# EAGLE design LandPatternBreakouts (EAGLE 6.5.0)
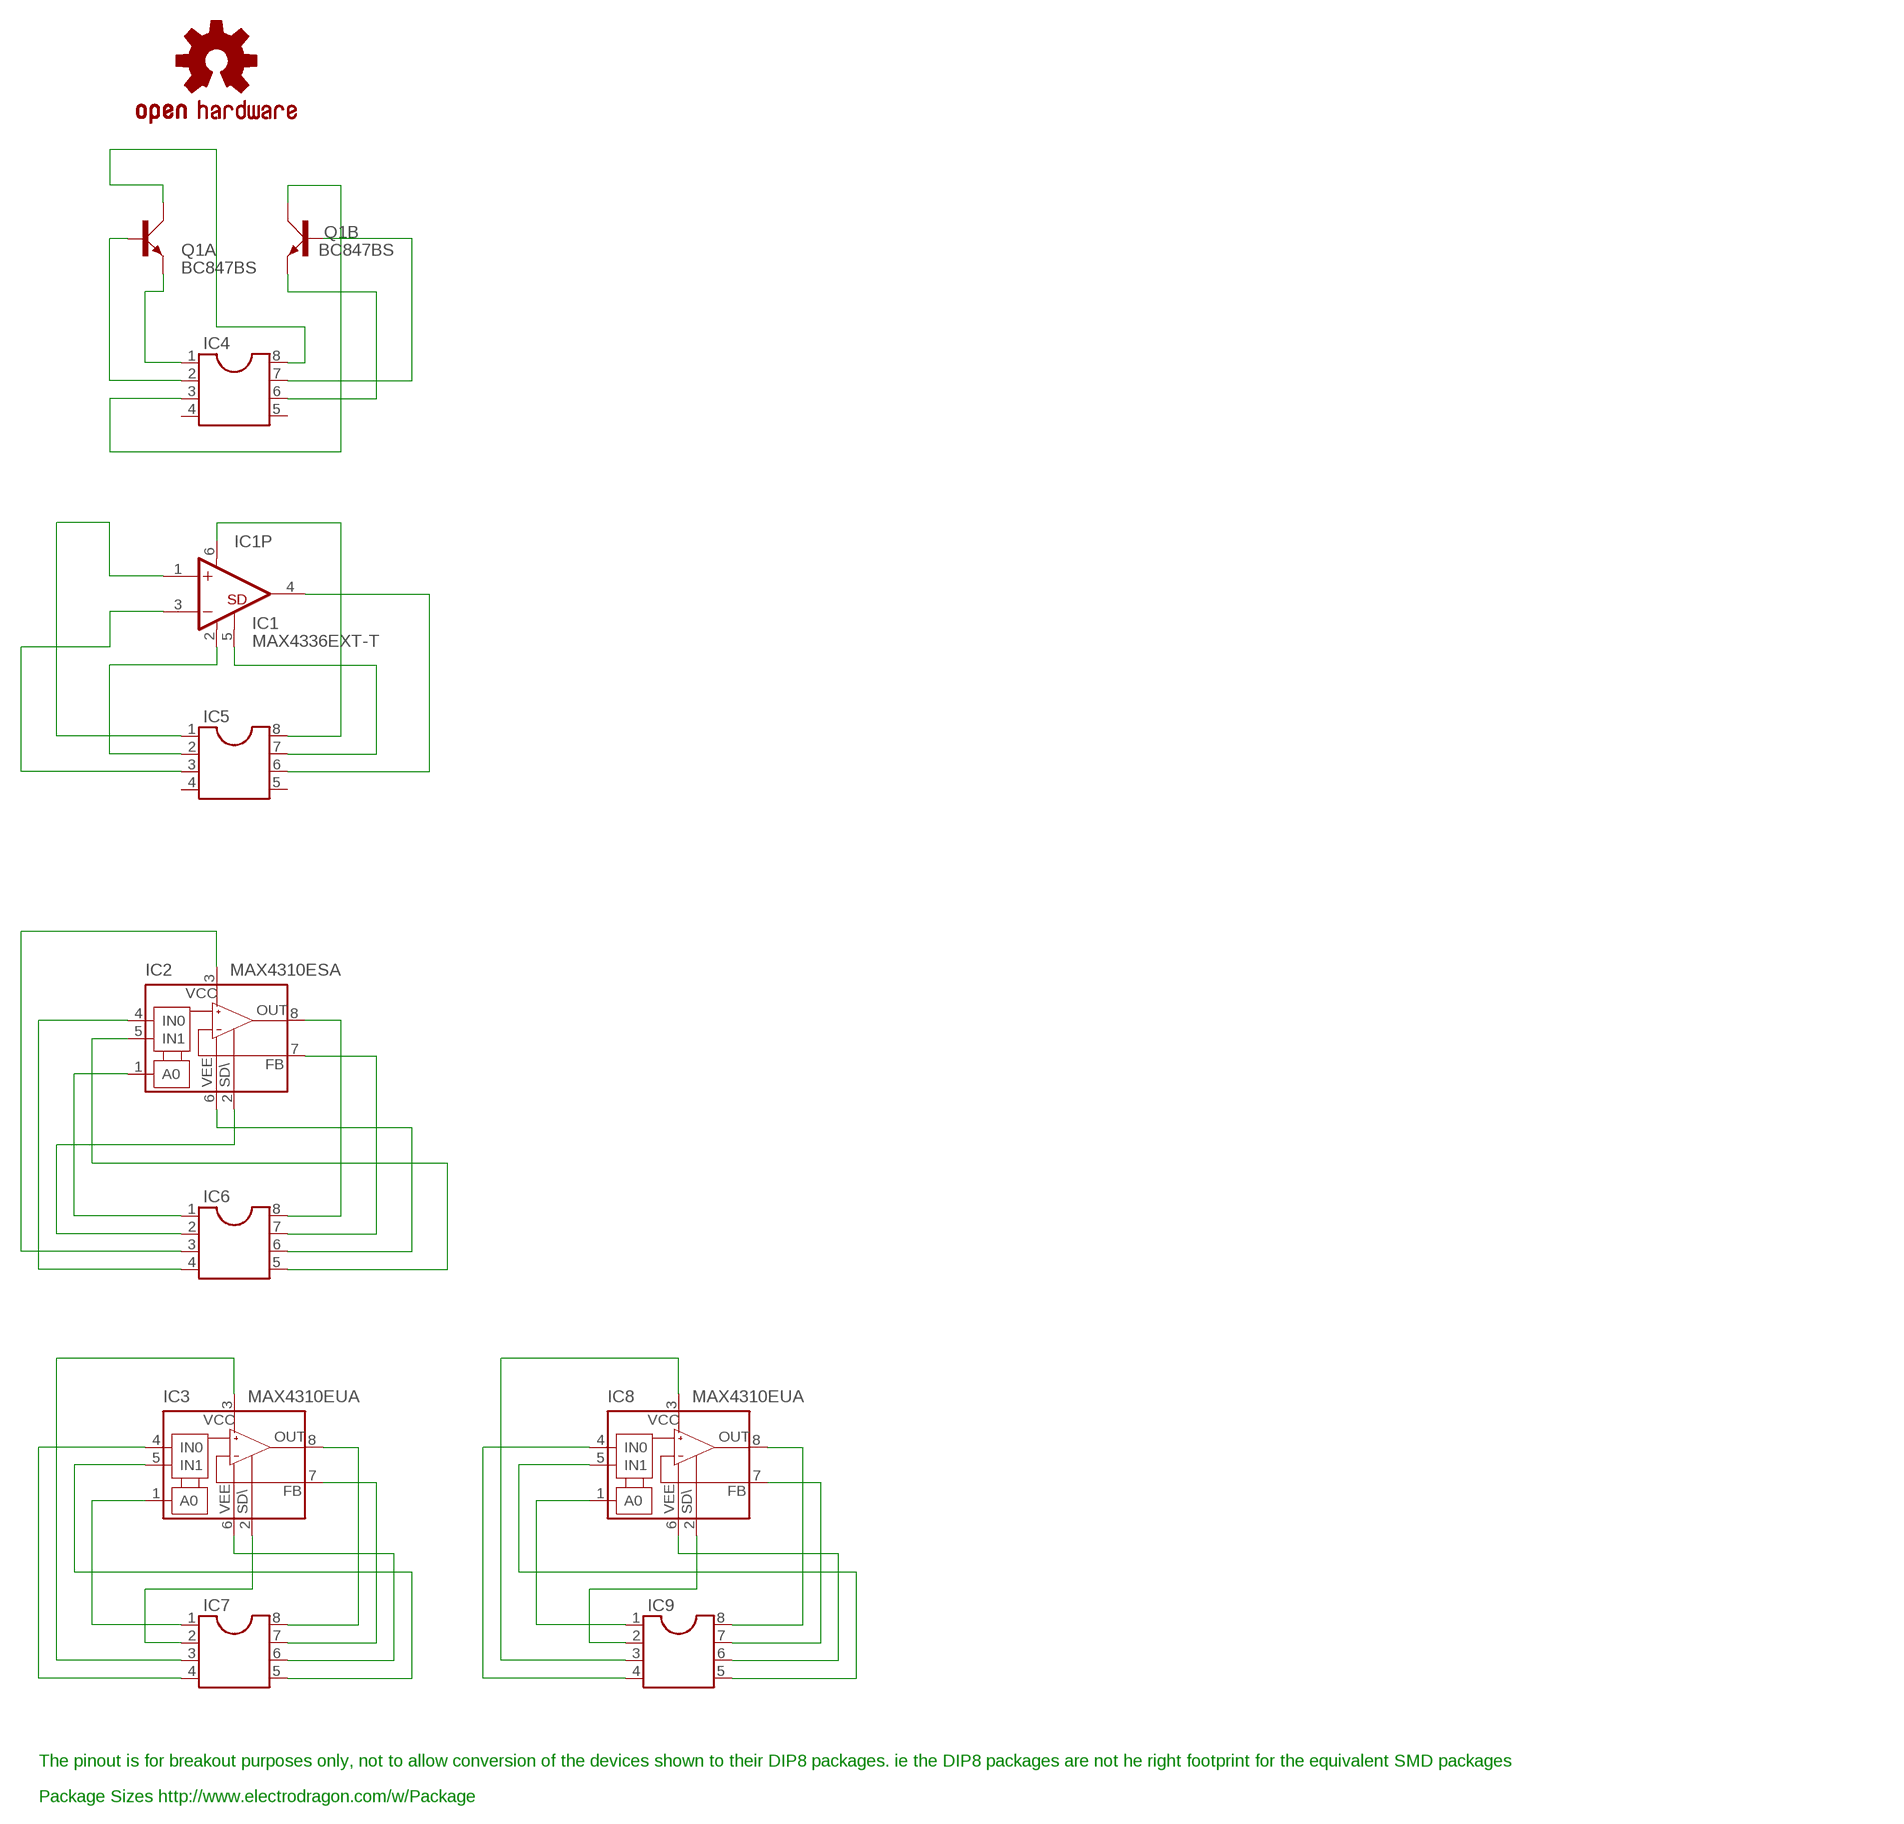
[diagram p0: schematic, sheet 1]

## Parts
IC1  MAX4336EXT-T  [SOT23-6L]
IC2  MAX4310ESA  [UMAX8]
IC3  MAX4310EUA  [SO08]
IC4  DIL8  [DIL08]
IC5  DIL8  [DIL08]
IC6  DIL8  [DIL08]
IC7  DIL8  [DIL08]
IC8  MAX4310EUA  [SO08]
IC9  DIL8  [DIL08]
LOGO1  OSHW-LOGOS  [OSHW-LOGO-S]
Q1  BC847BS  [SOT363_PHILIPS]

## Nets
N$1: IC1.1(+IN) IC5.1
N$2: IC1.2(V-) IC5.2
N$3: IC1.3(-IN) IC5.3
N$4: IC1.4(OUT) IC5.6
N$5: IC1.6(V+) IC5.8
N$6: IC2.1(A0) IC6.1
N$7: IC2.2(!SHDN) IC6.2
N$8: IC1.5(SHUTDOWN) IC5.7
N$9: IC2.3(V+) IC6.3
N$10: IC2.4(IN0) IC6.4
N$11: IC2.5(IN1) IC6.5
N$12: IC2.6(V-) IC6.6
N$13: IC2.7(FB) IC6.7
N$14: IC2.8(OUT) IC6.8
N$15: IC3.4(IN0) IC7.4
N$16: IC3.2(!SHDN) IC7.2
N$17: IC3.3(V+) IC7.3
N$18: IC3.5(IN1) IC7.5
N$19: IC3.6(V-) IC7.6
N$20: IC3.7(FB) IC7.7
N$21: IC3.8(OUT) IC7.8
N$22: IC3.1(A0) IC7.1
N$23: IC4.8 Q1.6(A:C)
N$24: IC4.2 Q1.2(A:B)
N$25: IC4.1 Q1.1(A:E)
N$26: IC4.6 Q1.4(B:E)
N$27: IC4.3 Q1.3(B:C)
N$28: IC4.7 Q1.5(B:B)
N$29: IC8.2(!SHDN) IC9.2
N$30: IC8.3(V+) IC9.3
N$31: IC8.4(IN0) IC9.4
N$32: IC8.5(IN1) IC9.5
N$33: IC8.6(V-) IC9.6
N$34: IC8.7(FB) IC9.7
N$35: IC8.8(OUT) IC9.8
N$36: IC8.1(A0) IC9.1
Unconnected: IC4.4 IC4.5 IC5.4 IC5.5

## Notes on the sheet
- The pinout is for breakout purposes only, not to allow conversion of the devices shown to their DIP8 packages. ie the DIP8 packages are not he right footprint for the equivalent SMD packages
- Package Sizes http://www.electrodragon.com/w/Package

## Library data of the parts
IC1 = maxim:MAX4336: 50mA IOUT, Rail-to-Rail I/O Op Amp with Shutdown/Mute Source: http://datasheets.maxim-ic.com/en/ds/MAX4335-MAX4338.pdf; MPN: MAX4336EXT+T; OC_FARNELL: unknown; OC_NEWARK: 27M4090
IC2 IC3 IC8 = maxim:MAX4310: Video Multiplexer-Amplifier High-Speed, Low-Power, Single-Supply, Multichannel; OC_FARNELL: unknown; OC_NEWARK: unknown
IC4-IC7 IC9 = ic-package:DIL8: Dual In Line / Socket
LOGO1 = SparkFun-Aesthetics:OSHW-LOGO: Open Source Hardware Logo This logo indicates the piece of hardware it is found on incorporates a OSHW license and/or adheres to the definition of open source hardware found here: http://freedomdefined.org/OSHW
Q1 = transistor-small-signal:BC847BS: NPN general purpose double transistor Source: http://www.farnell.com/datasheets/2466.pdf

## Board
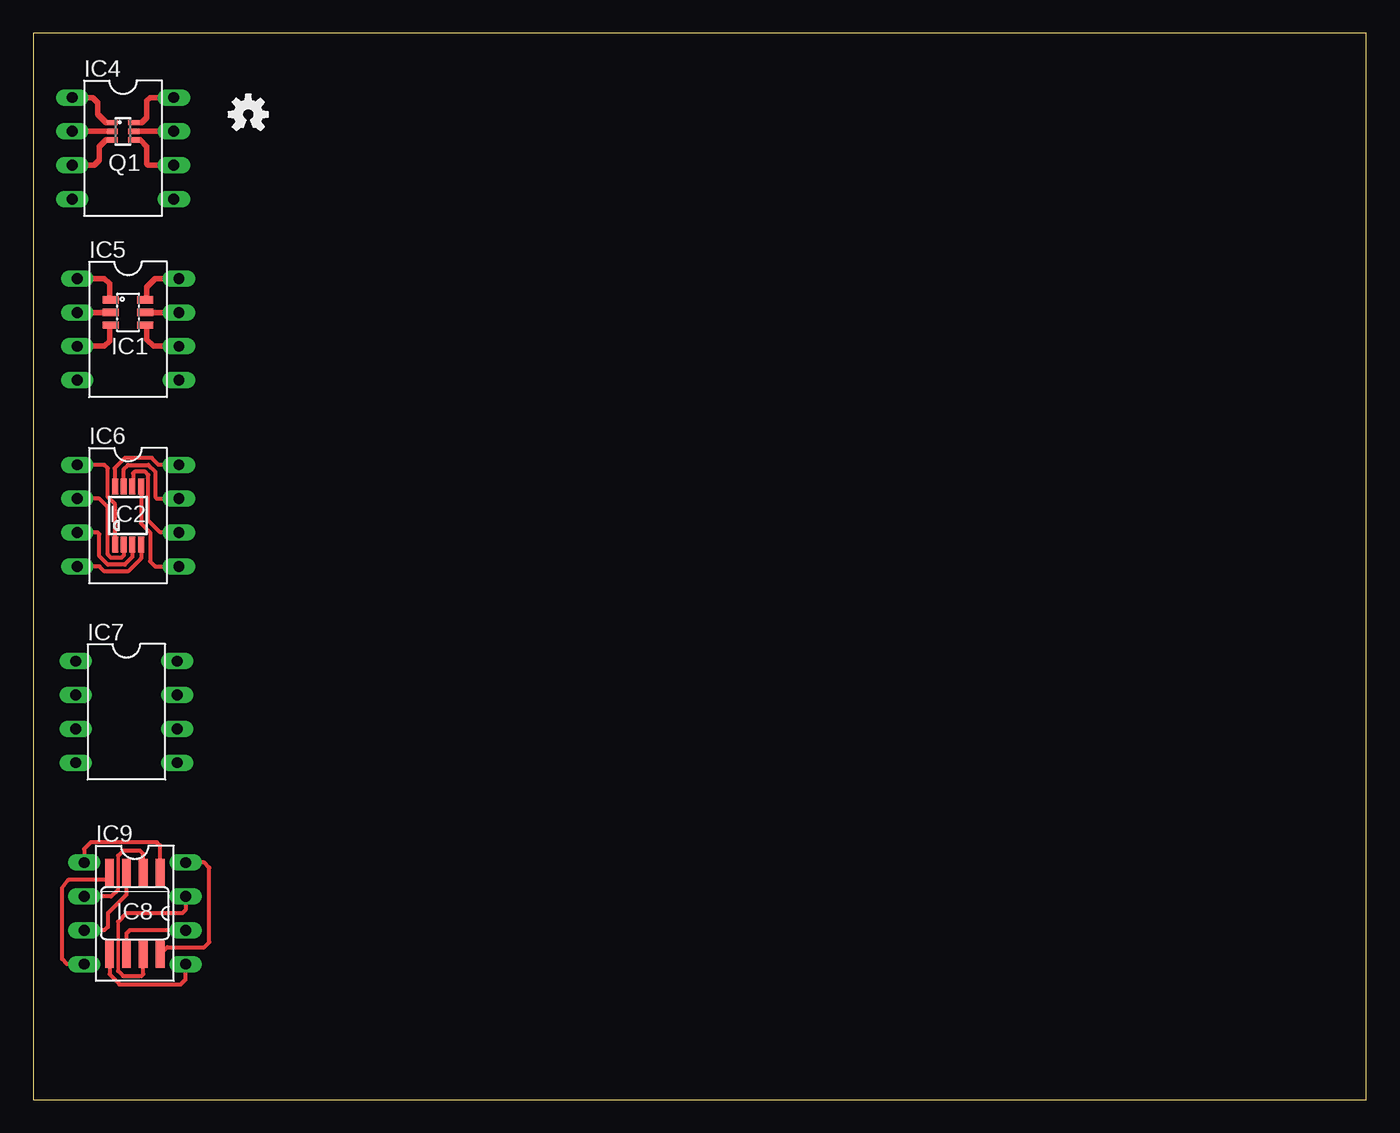
[diagram p1: board, top side]
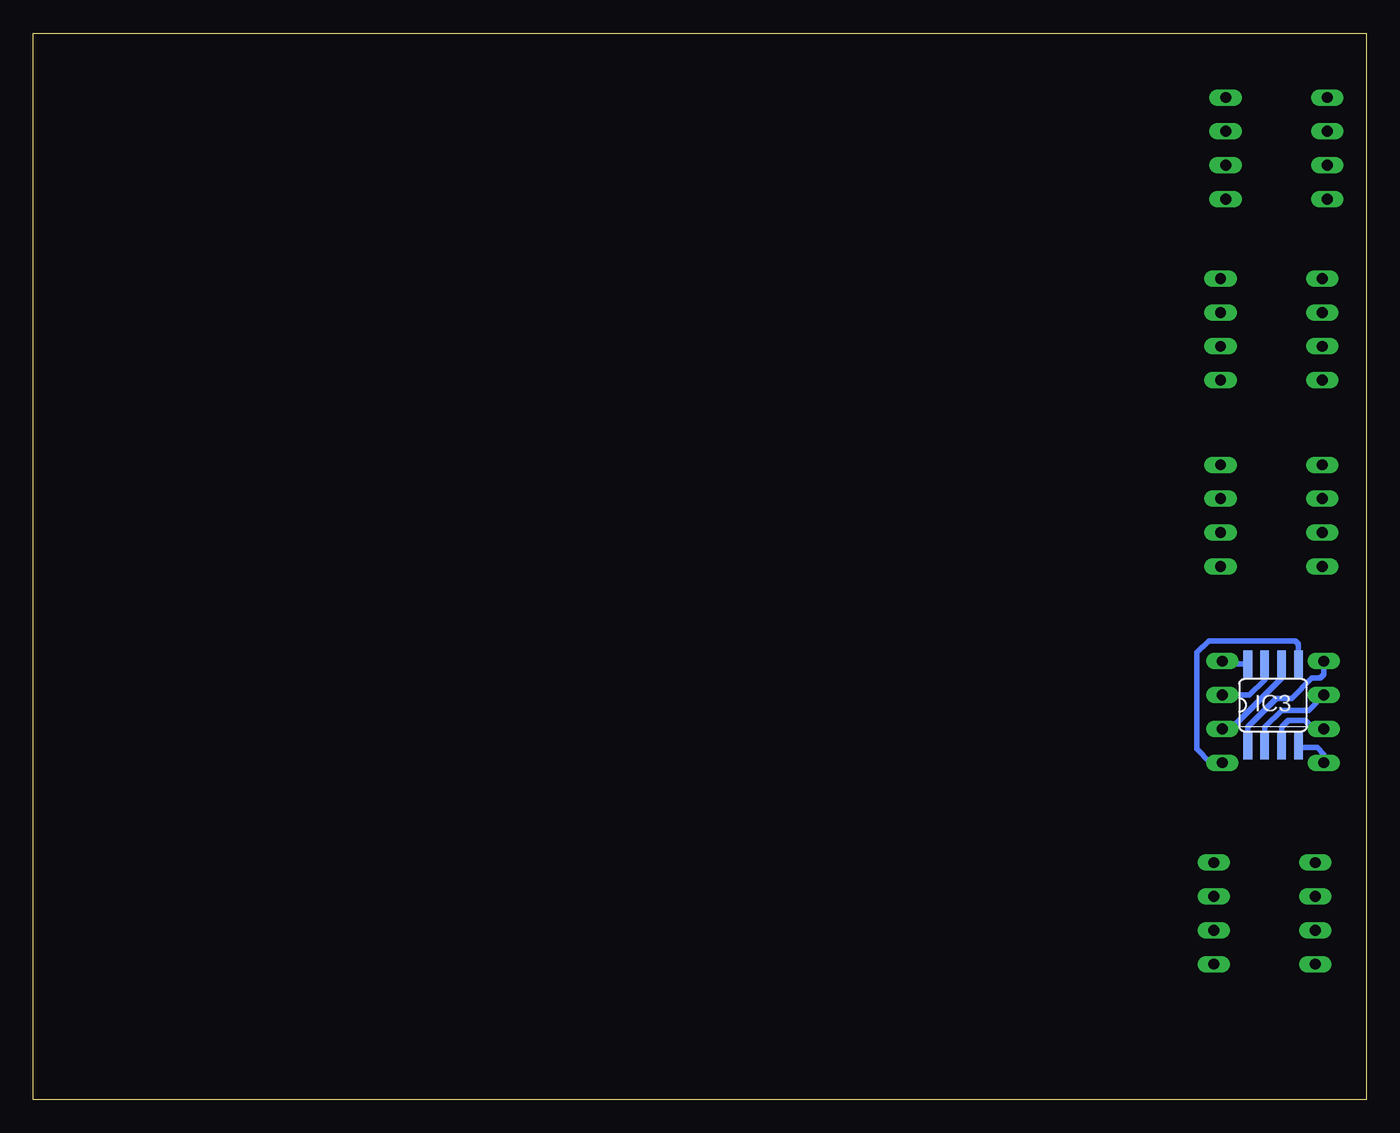
[diagram p2: board, bottom side, seen from below]

Size 100 x 80 mm. Coordinates in mm from the lower left corner, seen from the top.
Outline: 0,0 100,0 100,80 0,80 0,0
Copper layers (1*16): Top 0.0356mm / dielectric 1.5011mm / Bottom 0.0356mm
Design rules "LaenPCBOrder": minimum track width 6mil, minimum drill 13mil, track to track 6mil, track to pad 6mil, pad to pad 6mil, via to via 6mil, smd to smd 6mil, copper to edge 15mil, drill to drill 6mil, minimum pad ring 7mil, minimum via ring 7mil, stop-mask expansion 3mil, vias tented up to drill 0mil, thermal gap 10mil

### Footprints (pad centres in the part's own frame; a part is rotated, then mirrored left to right if it is on the bottom)
SOT23-6L = smd 0.55 x 1.2: 1 -0.95,-1.3; 2 0,-1.3; 3 0.95,-1.3; 4 0.95,1.3; 5 0,1.3; 6 -0.95,1.3
UMAX8 = smd 0.45 x 1.2: 1 -0.975,-2.175; 2 -0.325,-2.175; 3 0.325,-2.175; 4 0.975,-2.175; 5 0.975,2.175; 6 0.325,2.175; 7 -0.325,2.175; 8 -0.975,2.175
SO08 = smd 0.66 x 2.032: 1 -1.905,-3.073; 2 -0.635,-3.073; 3 0.635,-3.073; 4 1.905,-3.073; 5 1.905,3.073; 6 0.635,3.073; 7 -0.635,3.073; 8 -1.905,3.073
DIL08 = drill 0.813 long: 1 -3.81,-3.81; 2 -1.27,-3.81; 3 1.27,-3.81; 4 3.81,-3.81; 5 3.81,3.81; 6 1.27,3.81; 7 -1.27,3.81; 8 -3.81,3.81
SOT363_PHILIPS = smd 0.4 x 0.8: 1 -0.65,-0.8; 2 0,-0.8; 3 0.65,-0.8; 4 0.65,0.8; 5 0,0.8; 6 -0.65,0.8

### Placement (x,y rotation side)
IC1  7.11,59.05 270 top
IC2  7.11,43.81 0 top
IC3  6.99,29.59 0 bottom
IC4  6.73,71.37 270 top
IC5  7.11,57.78 270 top
IC6  7.11,43.81 270 top
IC7  6.99,29.08 270 top
IC8  7.62,13.97 180 top
IC9  7.62,13.97 270 top
LOGO1  16.13,73.91 0 top
Q1  6.73,72.64 270 top

### Tracks (layer width: path | path; a pad name or v marks a point on that pad's centre or on a via)
N$1
  Top 0.406: IC1.1 5.71,60.1 5.71,61.21 5.33,61.59 IC5.1
N$2
  Top 0.406: IC1.2 IC5.2
N$3
  Top 0.406: IC1.3 5.71,58.01 5.71,56.9 5.33,56.52 IC5.3
N$4
  Top 0.406: IC1.4 8.51,58.01 8.51,57.02 9.02,56.52 IC5.6
N$5
  Top 0.406: IC1.6 8.51,60.1 8.51,60.96 9.14,61.59 IC5.8
N$6
  Top 0.305: IC2.1 6.14,44.66 5.59,45.21 5.59,47.37 5.33,47.62 IC6.1
N$7
  Top 0.305: IC2.2 6.79,40.82 6.6,40.64 5.84,40.64 5.59,40.89 5.59,44.45 4.95,45.09 IC6.2
N$8
  Top 0.406: IC1.5 IC5.7
N$9
  Top 0.305: IC2.3 7.44,40.71 6.86,40.13 5.59,40.13 4.95,40.77 4.95,42.42 4.83,42.55 IC6.3
N$10
  Top 0.305: IC2.4 8.09,40.6 7.11,39.62 5.33,39.62 4.95,40.01 IC6.4
N$11
  Top 0.305: IC2.5 8.09,43.22 8.76,42.55 8.76,40.39 9.14,40.01 IC6.5
N$12
  Top 0.305: IC6.6 9.53,42.55 8.64,43.43 8.64,46.86 8.38,47.12 7.62,47.12 7.49,46.99 7.49,46.05 IC2.6
N$13
  Top 0.305: IC2.7 6.79,47.3 7.11,47.62 8.64,47.62 9.14,47.12 9.14,45.21 9.27,45.09 IC6.7
N$14
  Top 0.305: IC6.8 9.4,47.62 8.89,48.13 6.86,48.13 6.1,47.37 6.1,46.03 IC2.8
N$15
  Bottom 0.406: IC3.4 5.05,26.52 4.95,26.42 3.68,26.42 3.17,25.91 IC7.4
N$16
  Bottom 0.406: IC3.2 7.62,27.94 6.35,29.21 4.32,29.21 IC7.2
N$17
  Bottom 0.406: IC3.3 6.35,27.94 5.84,28.45 4.57,28.45 4.06,27.94 3.3,27.94 IC7.3
N$18
  Bottom 0.406: IC3.5 5.08,34.16 5.33,34.42 11.81,34.42 12.7,33.53 12.7,26.29 11.68,25.27 IC7.5
N$19
  Bottom 0.406: IC3.6 6.35,31.62 9.78,28.19 10.41,28.19 IC7.6
N$20
  Bottom 0.406: IC7.7 8.76,30.35 7.62,31.5 IC3.7
N$21
  Bottom 0.406: IC3.8 10.57,32.66 IC7.8
N$22
  Bottom 0.406: IC3.1 8.89,27.94 6.73,30.1 5.59,30.1 4.06,31.62 3.43,31.62 3.17,31.88 IC7.1
N$23
  Top 0.406: Q1.6 7.55,73.28 8.13,73.28 8.51,73.66 8.51,74.93 8.76,75.18 IC4.8
N$24
  Top 0.406: Q1.2 IC4.2
N$25
  Top 0.406: Q1.1 5.92,73.28 5.46,73.28 4.83,73.91 4.83,74.8 4.45,75.18 IC4.1
N$26
  Top 0.406: Q1.4 7.55,72.01 8,72.01 8.51,71.5 8.51,70.23 8.64,70.1 IC4.6
N$27
  Top 0.406: Q1.3 5.92,72.01 5.46,72.01 4.95,71.5 4.95,70.48 4.57,70.1 IC4.3
N$28
  Top 0.406: Q1.5 IC4.7
N$29
  Top 0.254: 6.35,18.29 6.35,15.75
  Top 0.305: IC8.2 8.26,18.41 8,18.67 6.73,18.67 6.35,18.29 | 6.35,15.75 5.84,15.24 IC9.2
N$30
  Top 0.305: IC8.3 6.99,15.37 5.59,13.97 5.59,12.95 5.33,12.7 IC9.3
N$31
  Top 0.305: IC9.4 2.54,10.16 2.16,10.54 2.16,15.88 2.67,16.51 5.71,16.51 IC8.4
N$32
  Top 0.305: IC8.5 5.71,9.4 6.48,8.64 11.05,8.64 11.43,9.02 IC9.5
N$33
  Top 0.305: IC9.6 7.24,12.7 6.99,12.45 IC8.6
N$34
  Top 0.254: 6.35,13.34 6.35,9.65
  Top 0.305: IC9.7 11.43,14.22 11.18,13.97 6.99,13.97 6.35,13.34 | 6.35,9.65 6.73,9.27 8.13,9.27 8.26,9.4 IC8.7
N$35
  Top 0.305: IC8.8 10.06,11.43 12.83,11.43 13.21,11.81 13.21,17.4 12.83,17.78 IC9.8
N$36
  Top 0.305: IC8.1 9.53,19.05 9.27,19.3 4.32,19.3 3.81,18.8 IC9.1